# Altium project CSI2-IMX8M-EVK_Rev02.PrjPcb
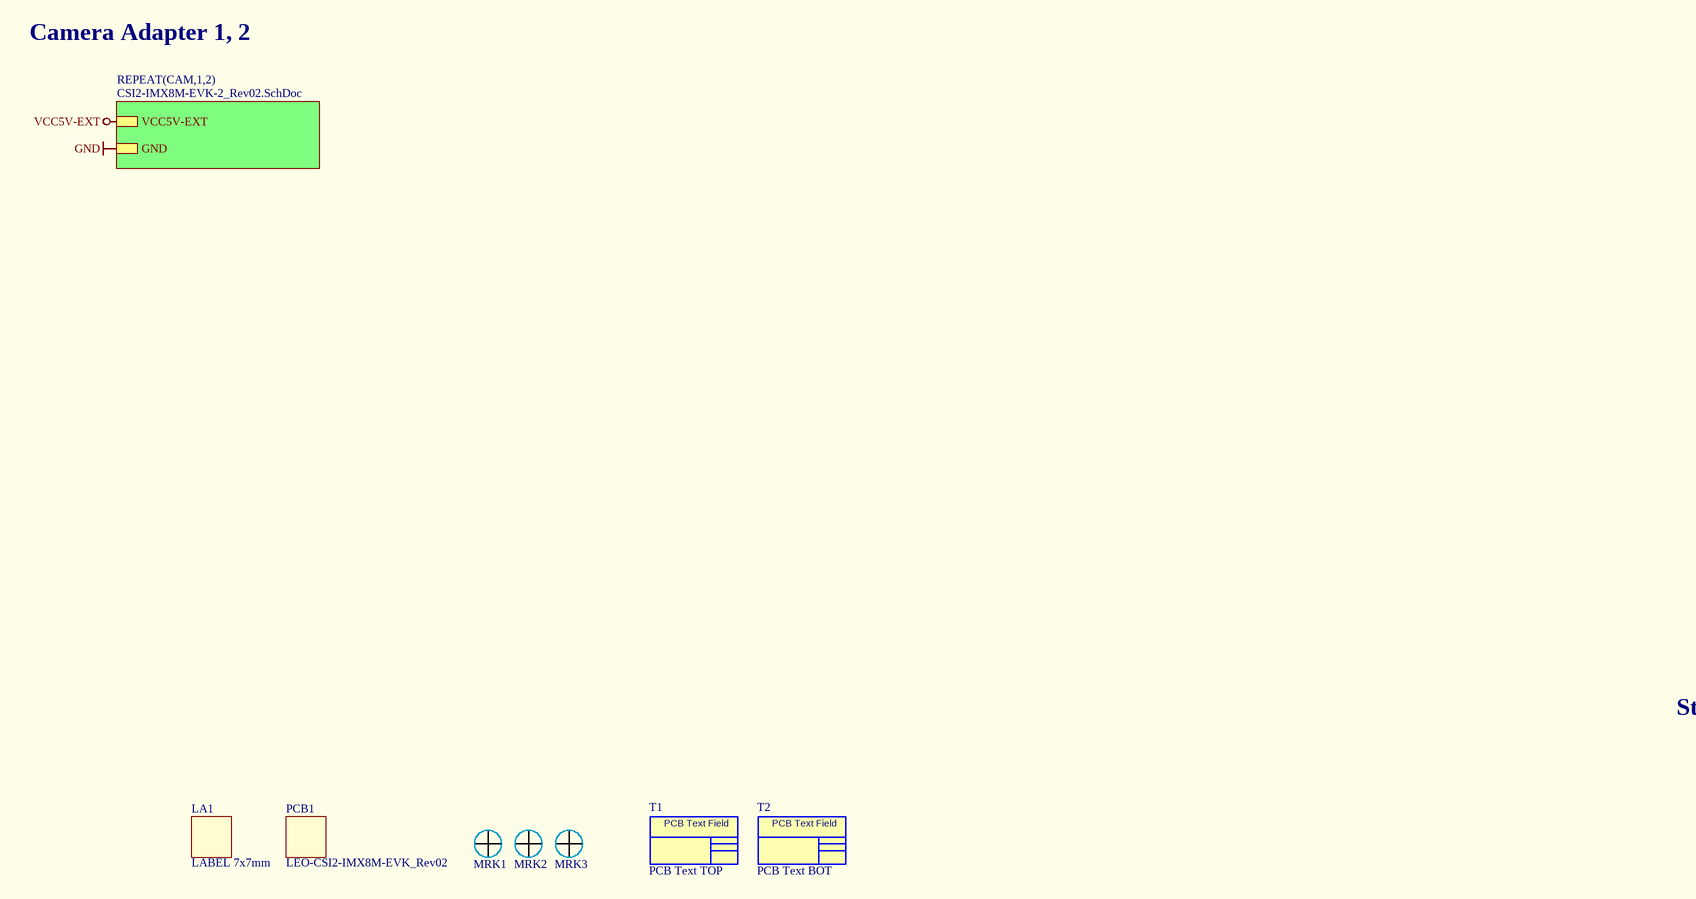
[diagram p0: CSI2-IMX8M-EVK-1_Rev02.SchDoc]
AuthorPCB: OFU/IHA; RevisionPCB: 02; Title: CSI2-IMX8M-EVK; VariantName: standard
2 sheets, 127 parts. Net scope: strictly hierarchical (ports join the sheet entries above them; power ports are local).
Board file: CSI2-IMX8M-EVK_Rev02.PcbDoc
Sheets:
  CSI2-IMX8M-EVK-1_Rev02.SchDoc
    CAM1 = CSI2-IMX8M-EVK-2_Rev02.SchDoc
    CAM2 = CSI2-IMX8M-EVK-2_Rev02.SchDoc

## Sheet CSI2-IMX8M-EVK-1_Rev02.SchDoc: CSI2-IMX8M-EVK
size A3; PageSetup: Record=PageOptions|CenterHorizontal=True|CenterVertical=True|PrintScale=0.73|XCorrection=1.00|YCorrection=1.00|PrintKind=2|BorderSize=5000000|LeftOffset=0|BottomOffset=0|Orientation=2|PaperLength=1000|PaperWidth=1000|Scale=100|PaperSource=7|PrintQuality=-4|MediaType=1|DitherType=10|PrintScaleMode=1|PaperKind=A3; CheckedBy: OFU/IHA; Author: CWA; CompanyName: Allied Vision Technologies GmbH; Address1: Taschenweg 2a; Address2: 07646 Stadtroda; Address3: Germany; Revision: 02; SheetNumber: 1; SheetTotal: 2

### Parts
LA1  LABEL 7x7mm  [PCB LABEL 7x7]
MRK1  Marker Single Layer  [PCB_Marker_Pad_top]  (value not drawn)
MRK2  Marker Single Layer  [PCB_Marker_Pad_top]  (value not drawn)
MRK3  Marker Single Layer  [PCB_Marker_Pad_top]  (value not drawn)
PCB1  LEO-CSI2-IMX8M-EVK_Rev02  (mechanical)
T1  PCB Text TOP  [PCB TEXTFIELD TOP 2]  (no BOM)
T2  PCB Text BOT  [PCB TEXTFIELD BOT 2]  (no BOM)

### Sub-sheets
REPEAT(CAM,1,2) = CSI2-IMX8M-EVK-2_Rev02.SchDoc: VCC5V-EXT, GND

### Notes on the sheet
- Camera Adapter 1, 2
- Strict Hierarchical Design (Power Ports local)
- Title:
- PCB:
- PCBA:
- 3
- Confidential
- Author:
- Date:
- Checked by:
- Page:
- of
- 1
- 2
- File:
- No.
- Changes
- Rev.:
- Name:
- (in symbol PCB TEXT FIELD BOT) PCB Text Field
- (in symbol PCB TEXT FIELD TOP) PCB Text Field

### Library data of the parts
LA1 = PCB LABEL 7x7: Manufacturer: several; Manufacturer Part Number: several
MRK1-MRK3 = PCB Marker Pad Single Layer: Position Marker for PCBs
PCB1 = PCB: PCB ML04; Manufacturer: several
T1 = PCB TEXT FIELD TOP: PCB Textfield TOP
T2 = PCB TEXT FIELD BOT: PCB Textfield BOT

## Sheet CSI2-IMX8M-EVK-2_Rev02.SchDoc: CSI2-IMX8M-EVK
size A3; PageSetup: Record=PageOptions|CenterHorizontal=True|CenterVertical=True|PrintScale=0.73|XCorrection=1.00|YCorrection=1.00|PrintKind=2|BorderSize=5000000|LeftOffset=0|BottomOffset=0|Orientation=2|PaperLength=1000|PaperWidth=1000|Scale=100|PaperSource=7|PrintQuality=-4|MediaType=1|DitherType=10|PrintScaleMode=1|PaperKind=A3; CheckedBy: OFU/IHA; Author: CWA; CompanyName: Allied Vision Technologies GmbH; Address1: Taschenweg 2a; Address2: 07646 Stadtroda; Address3: Germany; Revision: 02; SheetNumber: 2; SheetTotal: 2
Used 2 times, as channels CAM1, CAM2. Parts and nets are listed once, with the designators drawn on the sheet.
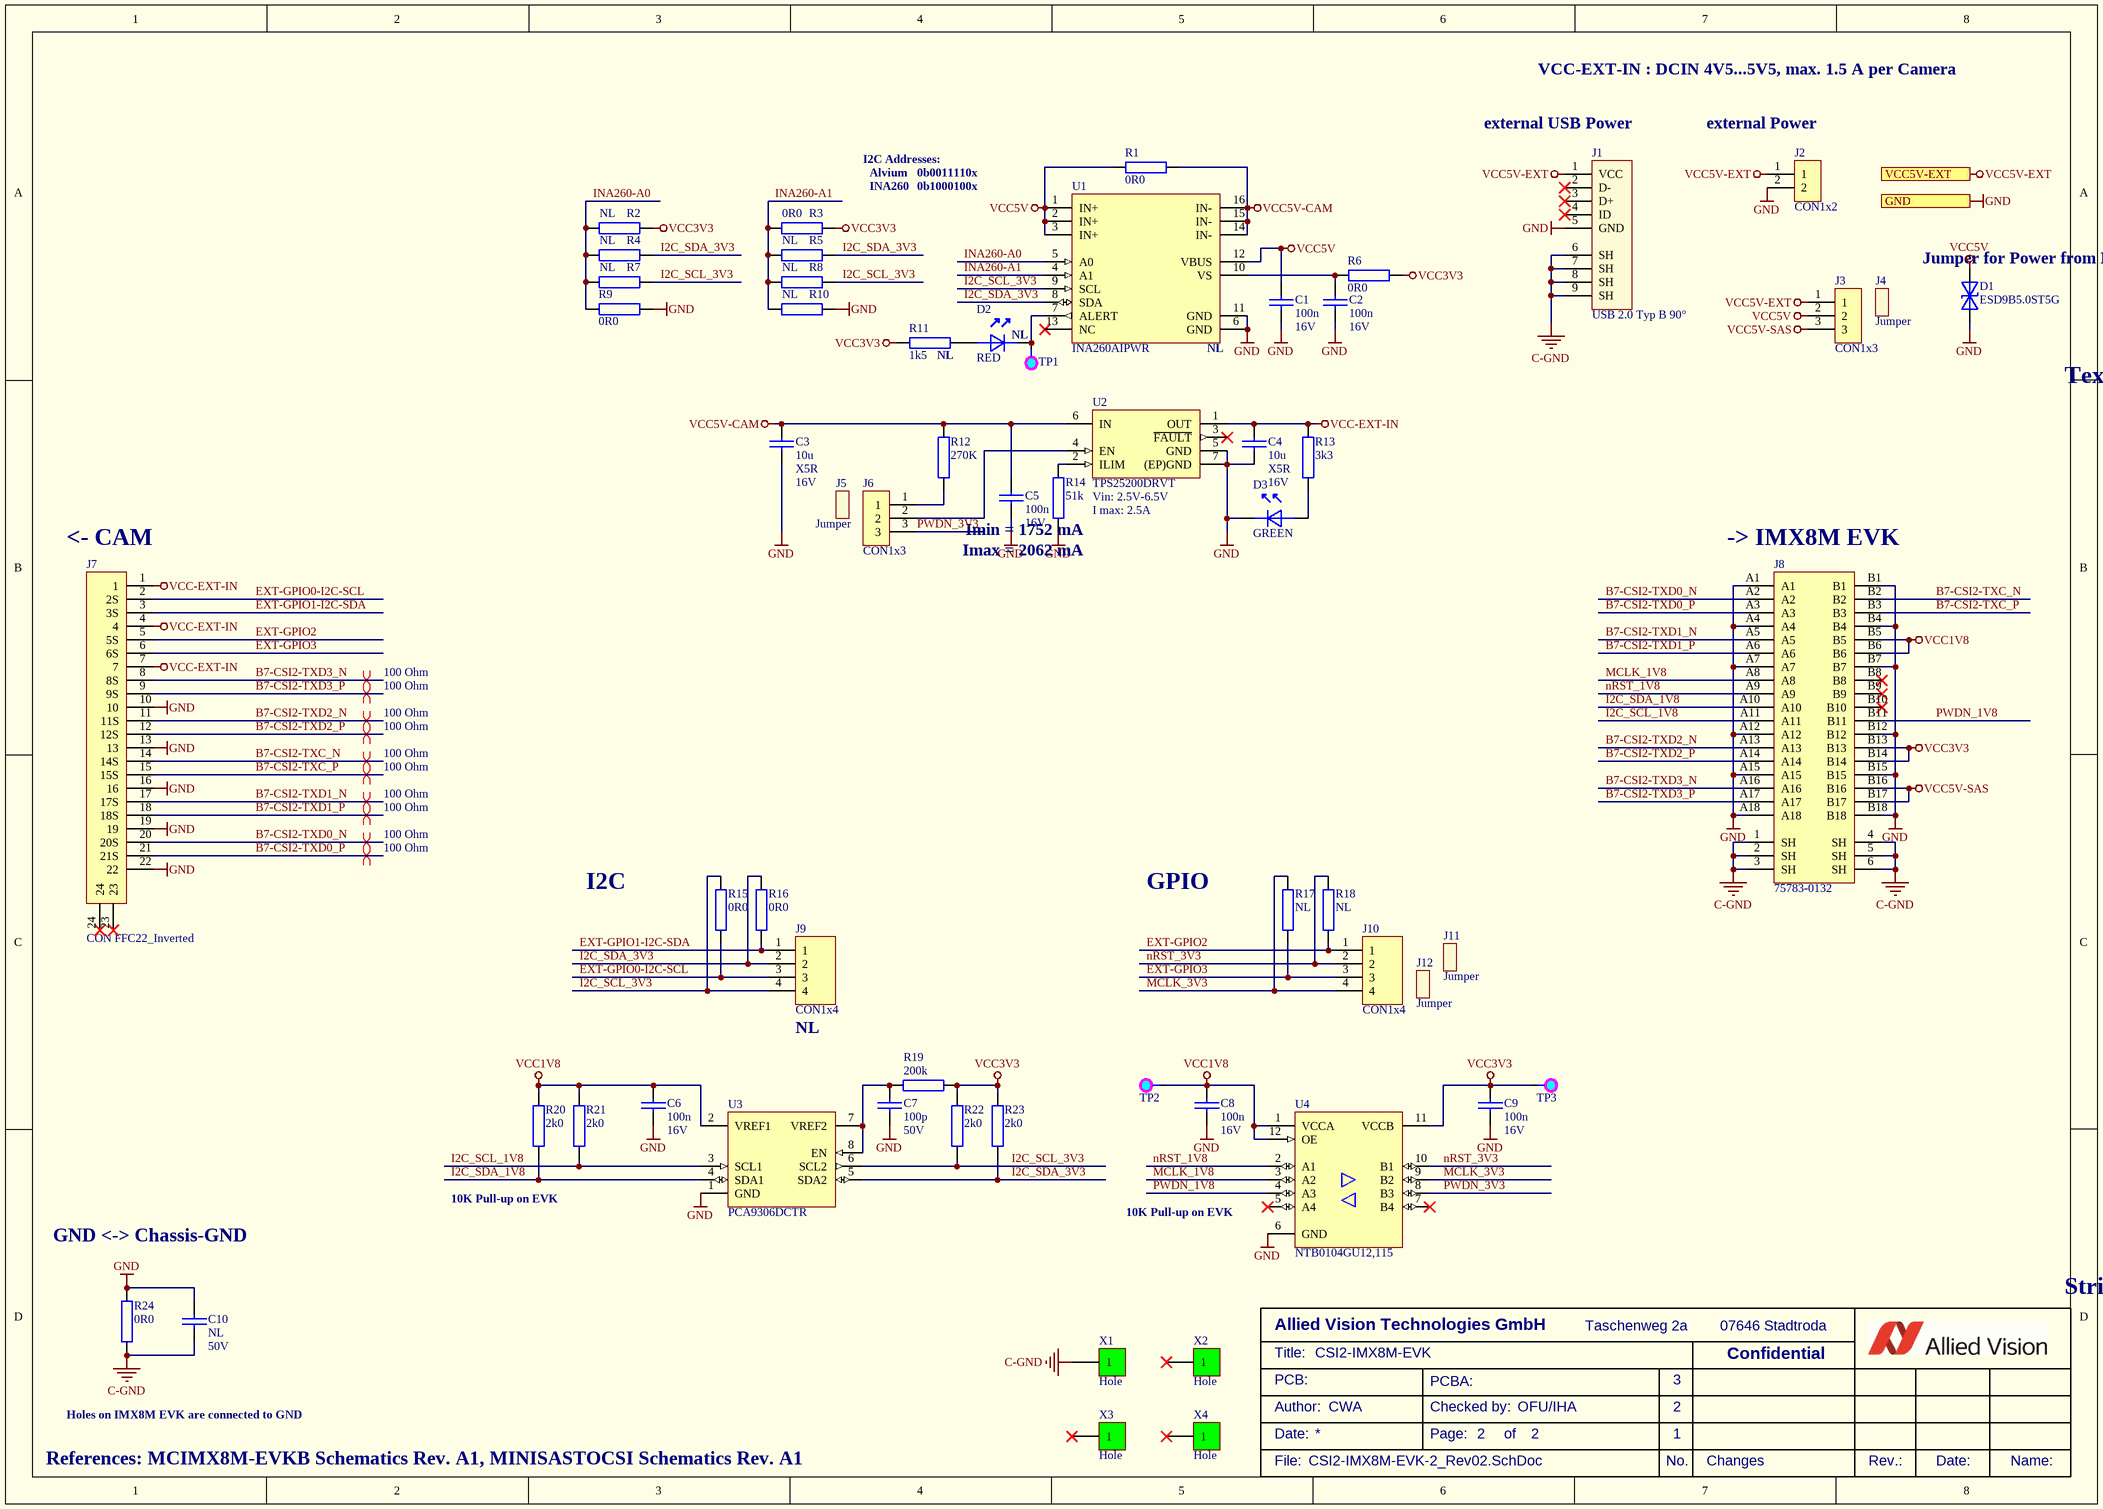
[diagram p1: CSI2-IMX8M-EVK-2_Rev02.SchDoc]

### Parts
C1  100n  Voltage: 16V  [C-0402_0.55]
C2  100n  Voltage: 16V  [C-0402_0.55]
C3  10u  Dielectric: X5R  Voltage: 16V  [C-0805_1.4]
C4  10u  Dielectric: X5R  Voltage: 16V  [C-0805_1.4]
C5  100n  Voltage: 16V  [C-0402_0.55]
C6  100n  Voltage: 16V  [C-0402_0.55]
C7  100p  Voltage: 50V  [C-0402_0.55]
C8  100n  Voltage: 16V  [C-0402_0.55]
C9  100n  Voltage: 16V  [C-0402_0.55]
C10  NL  Voltage: 50V  [C-0603_1.0]
D1  ESD9B5.0ST5G  [D-SOD923]
D2  RED  [D-0603-LED]
D3  GREEN  [D-0603-LED]
J1  USB 2.0 Typ B 90°  [J-629105150521]
J2  CON1x2  [CON 1x2 RM2.54]
J3  CON1x3  [CON 1x3 RM2.54]
J4  Jumper  [J-JUMPER-2.54]
J5  Jumper  [J-JUMPER-2.54]
J6  CON1x3  [CON 1x3 RM2.54]
J7  CON FFC22_Inverted  [J-FH55-22S-0.5SH - Inverted Pins]
J8  75783-0132  [J-757830132]
J9  CON1x4  [CON 1x4 RM2.54]
J10  CON1x4  [CON 1x4 RM2.54]
J11  Jumper  [J-JUMPER-2.54]
J12  Jumper  [J-JUMPER-2.54]
R1  0R0  [R-0603_0.6]
R2  NL  [R-0603_0.6]
R3  0R0  [R-0603_0.6]
R4  NL  [R-0603_0.6]
R5  NL  [R-0603_0.6]
R6  0R0  [R-0603_0.6]
R7  NL  [R-0603_0.6]
R8  NL  [R-0603_0.6]
R9  0R0  [R-0603_0.6]
R10  NL  [R-0603_0.6]
R11  1k5  [R-0402_0.4]
R12  270K  [R-0402_0.4]
R13  3k3  [R-0402_0.4]
R14  51k  [R-0402_0.4]
R15  0R0  [R-0603_0.6]
R16  0R0  [R-0603_0.6]
R17  NL  [R-0603_0.6]
R18  NL  [R-0603_0.6]
R19  200k  [R-0402_0.4]
R20  2k0  [R-0402_0.4]
R21  2k0  [R-0402_0.4]
R22  2k0  [R-0402_0.4]
R23  2k0  [R-0402_0.4]
R24  0R0  [R-0603_0.6]
TP1  TP  [TP_16_10]  (value not drawn)  (no BOM)
TP2  TP  [TP_16_10]  (value not drawn)  (no BOM)
TP3  TP  [TP_16_10]  (value not drawn)  (no BOM)
U1  INA260AIPWR  [IC-TSSOP16 6.4x5.1x1.2]
U2  TPS25200DRVT  Vin: 2.5V-6.5V  I max: 2.5A  [IC-DFN06_2.0x2.0x0.8]
U3  PCA9306DCTR  [IC-TSSOP8_3.15x4.25x1.3]
U4  NTB0104GU12,115  [IC-XQFN12_1.7x2x0.5]
X1  Hole  [HOLE-2.6-5.0-DK]  (no BOM)
X2  Hole  [HOLE-2.6-5.0-DK]  (no BOM)
X3  Hole  [HOLE-2.6-5.0-DK]  (no BOM)
X4  Hole  [HOLE-2.6-5.0-DK]  (no BOM)

### Ports
GND, VCC5V-EXT

### Nets
C-GND: C10.2 J1.6(SH) J1.7(SH) J1.8(SH) J1.9(SH) J8.1(SH) J8.2(SH) J8.3(SH) J8.4(SH) J8.5(SH) J8.6(SH) R24.1 X1.1
GND: C1.2 C2.2 C3.2 C4.2 C5.2 C6.2 C7.2 C8.2 C9.2 C10.1 D1.A D3.K J1.5(GND) J2.2 J7.10 J7.13 J7.16 J7.19 J7.22 J8.A1 J8.A4 J8.A7 J8.A12 J8.A15 J8.A18 J8.B1 J8.B4 J8.B7 J8.B12 J8.B15 J8.B18 R9.1 R10.1 R14.1 R24.2 U1.6(GND) U1.11(GND) U2.5(GND) U2.7((EP)GND) U3.1(GND) U4.6(GND) ; port GND
VCC1V8: C6.1 C8.1 J8.B5 J8.B6 R20.1 R21.1 TP2.1 U3.2(VREF1) U4.1(VCCA) U4.12(OE)
VCC3V3: C9.1 J8.B13 J8.B14 R2.1 R3.1 R6.1 R11.1 R19.2 R22.2 R23.2 TP3.1 U4.11(VCCB)
VCC5V: C1.1 D1.K J3.2 R1.2 U1.1(IN+) U1.2(IN+) U1.3(IN+) U1.12(VBUS)
VCC5V-CAM: C3.1 C5.1 R1.1 R12.1 U1.14(IN-) U1.15(IN-) U1.16(IN-) U2.6(IN)
VCC5V-EXT: J1.1(VCC) J2.1 J3.1 ; port VCC5V-EXT
VCC5V-SAS: J3.3 J8.B16 J8.B17
VCC-EXT-IN: C4.1 J7.1 J7.4 J7.7 R13.1 U2.1(OUT)
B7-CSI2-TXC_N: J7.14(14S) J8.B2
B7-CSI2-TXC_P: J7.15(15S) J8.B3
B7-CSI2-TXD0_N: J7.20(20S) J8.A2
B7-CSI2-TXD0_P: J7.21(21S) J8.A3
B7-CSI2-TXD1_N: J7.17(17S) J8.A5
B7-CSI2-TXD1_P: J7.18(18S) J8.A6
B7-CSI2-TXD2_N: J7.11(11S) J8.A13
B7-CSI2-TXD2_P: J7.12(12S) J8.A14
B7-CSI2-TXD3_N: J7.8(8S) J8.A16
B7-CSI2-TXD3_P: J7.9(9S) J8.A17
EXT-GPIO0-I2C-SCL: J7.2(2S) J9.3 R15.1
EXT-GPIO1-I2C-SDA: J7.3(3S) J9.1 R16.1
EXT-GPIO2: J7.5(5S) J10.1 R18.1
EXT-GPIO3: J7.6(6S) J10.3 R17.1
I2C_SCL_1V8: J8.A11 R21.2 U3.3(SCL1)
I2C_SCL_3V3: J9.4 R7.1 R8.1 R15.2 R22.1 U1.9(SCL) U3.6(SCL2)
I2C_SDA_1V8: J8.A10 R20.2 U3.4(SDA1)
I2C_SDA_3V3: J9.2 R4.1 R5.1 R16.2 R23.1 U1.8(SDA) U3.5(SDA2)
INA260-A0: R2.2 R4.2 R7.2 R9.2 U1.5(A0)
INA260-A1: R3.2 R5.2 R8.2 R10.2 U1.4(A1)
MCLK_1V8: J8.A8 U4.3(A2)
MCLK_3V3: J10.4 R17.2 U4.9(B2)
nRST_1V8: J8.A9 U4.2(A1)
nRST_3V3: J10.2 R18.2 U4.10(B1)
PWDN_1V8: J8.B11 U4.4(A3)
PWDN_3V3: J6.3 U4.8(B3)
NetC2_1: C2.1 R6.2 U1.10(VS)
NetC7_1: C7.1 R19.1 U3.7(VREF2) U3.8(EN)
NetD2_A: D2.A R11.2
NetD2_K: D2.K TP1.1 U1.7(ALERT)
NetD3_A: D3.A R13.2
NetJ6_1: J6.1 R12.2
NetJ6_2: J6.2 U2.4(EN)
NetR14_2: R14.2 U2.2(ILIM)

Not connected (* = marked no-connect by the designer): J1 2(D-)* 3(D+)* 4(ID)*; J7 23* 24*; J8 B8* B9* B10*; U1 13(NC)*; U2 3(~{FAULT})*; U4 5(A4)* 7(B4)*; X2 1*; X3 1*; X4 1*

### Channels
CAM1: designators end in _CAM1; ports GND=GND VCC5V-EXT=VCC5V-EXT
CAM2: designators end in _CAM2; ports GND=GND VCC5V-EXT=VCC5V-EXT

### Layout directives
differential pair; net class 100 Ohm: B7-CSI2-TXC_N_CAM1, B7-CSI2-TXC_P_CAM1, B7-CSI2-TXD0_N_CAM1, B7-CSI2-TXD0_P_CAM1, B7-CSI2-TXD1_N_CAM1, B7-CSI2-TXD1_P_CAM1, B7-CSI2-TXD2_N_CAM1, B7-CSI2-TXD2_P_CAM1, B7-CSI2-TXD3_N_CAM1, B7-CSI2-TXD3_P_CAM1

### Notes on the sheet
- VCC-EXT-IN : DCIN 4V5...5V5, max. 1.5 A per Camera
- I2C Addresses:
- Alvium
- 0b0011110x
- (near J1) external USB Power
- (near J2) external Power
- INA260
- 0b1000100x
- Jumper for Power from EVK
- (near R11) NL
- (near D2) NL
- (near U1) NL
- Text on PCB: PWR from USB DCIN / SAS
- (near R14) Imin = 1752 mA
- (near J7) <- CAM
- Imax = 2062 mA
- (near J8) -> IMX8M EVK
- I2C
- GPIO
- (near J9) NL
- GND <-> Chassis-GND
- 10K Pull-up on EVK
- Strict Hierarchical Design (Power Ports local)
- Holes on IMX8M EVK are connected to GND
- References: MCIMX8M-EVKB Schematics Rev. A1, MINISASTOCSI Schematics Rev. A1
- Title:
- PCB:
- PCBA:
- 3
- Confidential
- Author:
- Date:
- Checked by:
- Page:
- of
- 1
- 2
- File:
- No.
- Changes
- Rev.:
- Name:

### Library data of the parts
C1 C2 C5 C6 C8 C9 = C 100N 10% 16V X7R 402: Capacitor Ceramic SMD/0402/16V/X7R/10%; KHK Part Number: K8340114; Manufacturer: several; Dielectric: X7R; Tolerance: 10%; Manufacturer Part Number: several; Supplier 1: Digi-Key; Supplier 2: Digi-Key; Supplier Part Number 1: 1276-1508-1-ND; Supplier Part Number 2: 311-1338-1-ND
C3 C4 = C 10U 16V X5R 0805: Capacitor Ceramic SMD/0805/16V/X5R/10%; KHK Part Number: K8340151; Manufacturer: several; Tolerance: 10%; Manufacturer Part Number: several; Supplier 1: Digi-Key; Supplier Part Number 1: 478-5165-1-ND
C7 = C 100P 50V X7R 0402: Capacitor Ceramic SMD/0402/50V/X7R/10%; KHK Part Number: K8340145; Manufacturer: several; Dielectric: X7R; Tolerance: 10%; Manufacturer Part Number: several; Supplier 1: Digi-Key; Supplier Part Number 1: 478-1089-1-ND
C10 = C X 0603: Capacitor Ceramic SMD/0603/50V/X7R/10%; Manufacturer: several; Dielectric: X7R; Tolerance: 10%; Manufacturer Part Number: several
D1 = D ESD9B5.0ST5G: DIODE TVS; 400W; 5.8-7.8V; BIDIRECT; KHK Part Number: 7250; Manufacturer: ON Semiconductor; Manufacturer Part Number: ESD9B5.0ST5G; Supplier 1: Digi-Key; Supplier Part Number 1: ESD9B5.0ST5GOSCT-ND
D2 = D LED 0603 red: Chip LED red 250mcd; KHK Part Number: 8145; Manufacturer: Würth; Manufacturer Part Number: 150060RS75000; Current: 20mA; Color: red; Supplier 1: Digi-Key; Supplier Part Number 1: 732-4978-1-ND
D3 = D LED 0603 green: Chip LED green 430mcd; KHK Part Number: 8172; Manufacturer: Würth; Manufacturer Part Number: 150060GS75000; Current: 20mA; Color: green; Supplier 1: Digi-Key; Supplier Part Number 1: 732-4971-1-ND
J1 = CON USB 2.0 Typ B 90°: Micro USB 2.0 Typ B 90°; KHK Part Number: 14360; Manufacturer: WE; Manufacturer Part Number: 629 105 150 521; Supplier 1: Digi-Key; Supplier Part Number 1: 732-5960-1-ND
J2 = CON 1x2 2.54 several: Header Vertical, 1x2 Pos, Pitch 2.54mm, Contact Length Mating 6.00mm, Contact Length Post 3.00mm, Insulation Height 2.54mm, Gold Plating; KHK Part Number: 15337; Manufacturer: several; Manufacturer Part Number: several; Supplier 1: Digi-Key; Supplier Part Number 1: WM8072-ND
J3 J6 = CON 1x3 2.54 several: Header Vertical, 1x3 Pos, Pitch 2.54mm, Contact Length Mating 6.00mm, Contact Length Post 3.00mm, Insulation Height 2.54mm, Gold Plating; KHK Part Number: 15338; Manufacturer: several; Manufacturer Part Number: several; Supplier 1: Digi-Key; Supplier Part Number 1: WM8073-ND
J4 J5 J11 J12 = CON Jumper 2.54mm: CON/JUMPER/STC02SYAN; 2-pin; 2.54mm; 3A; FEMALE; VERTICAL; BLACK; KHK Part Number: 13444; Manufacturer: several; Manufacturer Part Number: several; Supplier 1: Digi-Key; Supplier Part Number 1: S9000-ND
J7 = CON FFC22_FH55-22S-0.5SH_Inverted: FFC Connector 0.5mm shielded; KHK Part Number: 10357; Manufacturer: Hirose; Manufacturer Part Number: FH55-22S-0.5SH; Supplier 1: Mouser; Supplier Part Number 1: 798-FH55-22S-0.5SH
J8 = CON Molex 75783-0132: 36pin MINI SAS iPass Receptacle 0.8mm pitch; Manufacturer: Molex; KHK Part Number: 16136; Manufacturer Part Number: 75783-0132; Supplier 1: Digi-Key; Supplier Part Number 1: WM1118CT-ND
J9 J10 = CON 1x4 2.54 several: Header Vertical, 1x4 Pos, Pitch 2.54mm, Contact Length Mating 6.00mm, Contact Length Post 3.00mm, Insulation Height 2.54mm, Gold Plating; KHK Part Number: 15343; Manufacturer: several; Manufacturer Part Number: several; Supplier 1: Digi-Key; Supplier Part Number 1: WM8074-ND
R1 R3 R6 R9 R15 R16 R24 = R 0R0 1% 0603: Standard Resistor SMD/0603/1%/100mW/TK200; KHK Part Number: K8250041; Manufacturer: several; Tolerance: 1%; Manufacturer Part Number: several; Temperature Coefficient: *; Supplier 1: Digi-Key; Supplier Part Number 1: 311-0.0HRCT-ND
R2 R4 R5 R7 R8 R10 R17 R18 = R X 0603: Standard Resistor SMD/0603/1%/100mW/TK200; Temperature Coefficient: TK100; Tolerance: 1%
R11 = R 1K5 1% 0402: Standard Resistor SMD/0402/1%/63mW/TK100; KHK Part Number: K8250358; Manufacturer: several; Tolerance: 1%; Manufacturer Part Number: several; Supplier 1: Digi-Key; Supplier Part Number 1: 311-1.50KLRCT-ND
R12 = R 270K 1% 0402: Standard Resistor SMD/0402/1%/63mW/TK100; KHK Part Number: 3875; Manufacturer: several; Tolerance: 1%; Temperature Coefficient: TK100; Manufacturer Part Number: several; Supplier 1: Digi-Key; Supplier Part Number 1: CR0402-FX-2703GLFCT-ND
R13 = R 3k3 1% 0402: Standard Resistor SMD/0402/1%/63mW/TK100; KHK Part Number: K8250347; Manufacturer: several; Tolerance: 1%; Temperature Coefficient: TK100; Manufacturer Part Number: several; Supplier 1: Digi-Key; Supplier Part Number 1: 311-3.30KLRCT-ND
R14 = R 51K 1% 0402: Standard Resistor SMD/0402/1%/63mW/TK100; KHK Part Number: K8250273; Manufacturer: several; Tolerance: 1%; Temperature Coefficient: TK100; Manufacturer Part Number: several; Supplier 1: Digi-Key; Supplier Part Number 1: 311-51.0KLRCT-ND
R19 = R 200K 1% 0402: Standard Resistor SMD/0402/1%/63mW/TK100; KHK Part Number: K8250280; Manufacturer: several; Temperature Coefficient: TK100; Tolerance: 1%; Manufacturer Part Number: several; Supplier 1: Digi-Key; Supplier 2: Arrow; Supplier 3: Arrow; Supplier Part Number 1: 311-200KLRCT-ND; Supplier Part Number 2: CRCW0402200KFKED; Supplier Part Number 3: NRC04F2003TRF
R20-R23 = R 2k0 1% 0402: Standard Resistor SMD/0402/1%/63mW/TK100; KHK Part Number: K8250311; Manufacturer: several; Temperature Coefficient: TK100; Tolerance: 1%; Manufacturer Part Number: several; Supplier 1: Digi-Key; Supplier Part Number 1: 311-2KLRCT-ND
TP1-TP3 = TP_16_10: Testpoint: Pad=1,6mm; Hole=1,0mm
U1 = IC INA260: IC/PWR/CURR SHUNT MONITOR/2.7-5.5V;4.5mR/TSSOP16/5.0x4.4x1.2mm; KHK Part Number: 16206; Manufacturer: TI; Manufacturer Part Number: INA260AIPWR; Supplier 1: Digi-Key; Supplier Part Number 1: 296-47777-1-ND
U2 = IC  TPS25200DRVT: IC/PWR/LOADSW;2V5-6V5;2A5;0R099/6-WDFN/2x2x0.8mm; KHK Part Number: 14277; Manufacturer: Texas Instruments; Manufacturer Part Number: TPS25200DRVT; Supplier 1: Digi-Key; Supplier Part Number 1: 296-37760-1-ND
U3 = IC PCA9306DCTR: IC/LOGIC/LEVELSHIFTER;I2C;AUTO-DIR;1V2-5V/SSOP-8/4.25x3.15x1.3mm; KHK Part Number: 9555; Manufacturer: TI; Manufacturer Part Number: PCA9306DCTR; Supplier 1: Digi-Key; Supplier Part Number 1: 296-18509-1-ND
U4 = IC NTB0104GU12,115: IC/LOGIC/Levelshifter;Auto-Dir;Bidirectional;Push-Pull;-40-+125°C/; Manufacturer: NXP; KHK Part Number: 14383; Manufacturer Part Number: NTB0104GU12,115; Supplier 1: Digi-Key; Supplier Part Number 1: 568-5204-1-ND
X1-X4 = PCB HOLE M2.5-5-DK: HOLE M2.5

## Nets that join several sheets
GND: CAM1 (41 pins), CAM2 (41 pins)
VCC5V-EXT: CAM1 (J1_CAM1.1 J2_CAM1.1 J3_CAM1.1), CAM2 (J1_CAM2.1 J2_CAM2.1 J3_CAM2.1)

## Assembly variants
standard: not fitted D2_CAM1 D2_CAM2 J9_CAM1 J9_CAM2 R11_CAM1 R11_CAM2 U1_CAM1 U1_CAM1 U1_CAM2 U1_CAM2